# Altium schematic sheet [9] EXTRAS.SchDoc
size A4
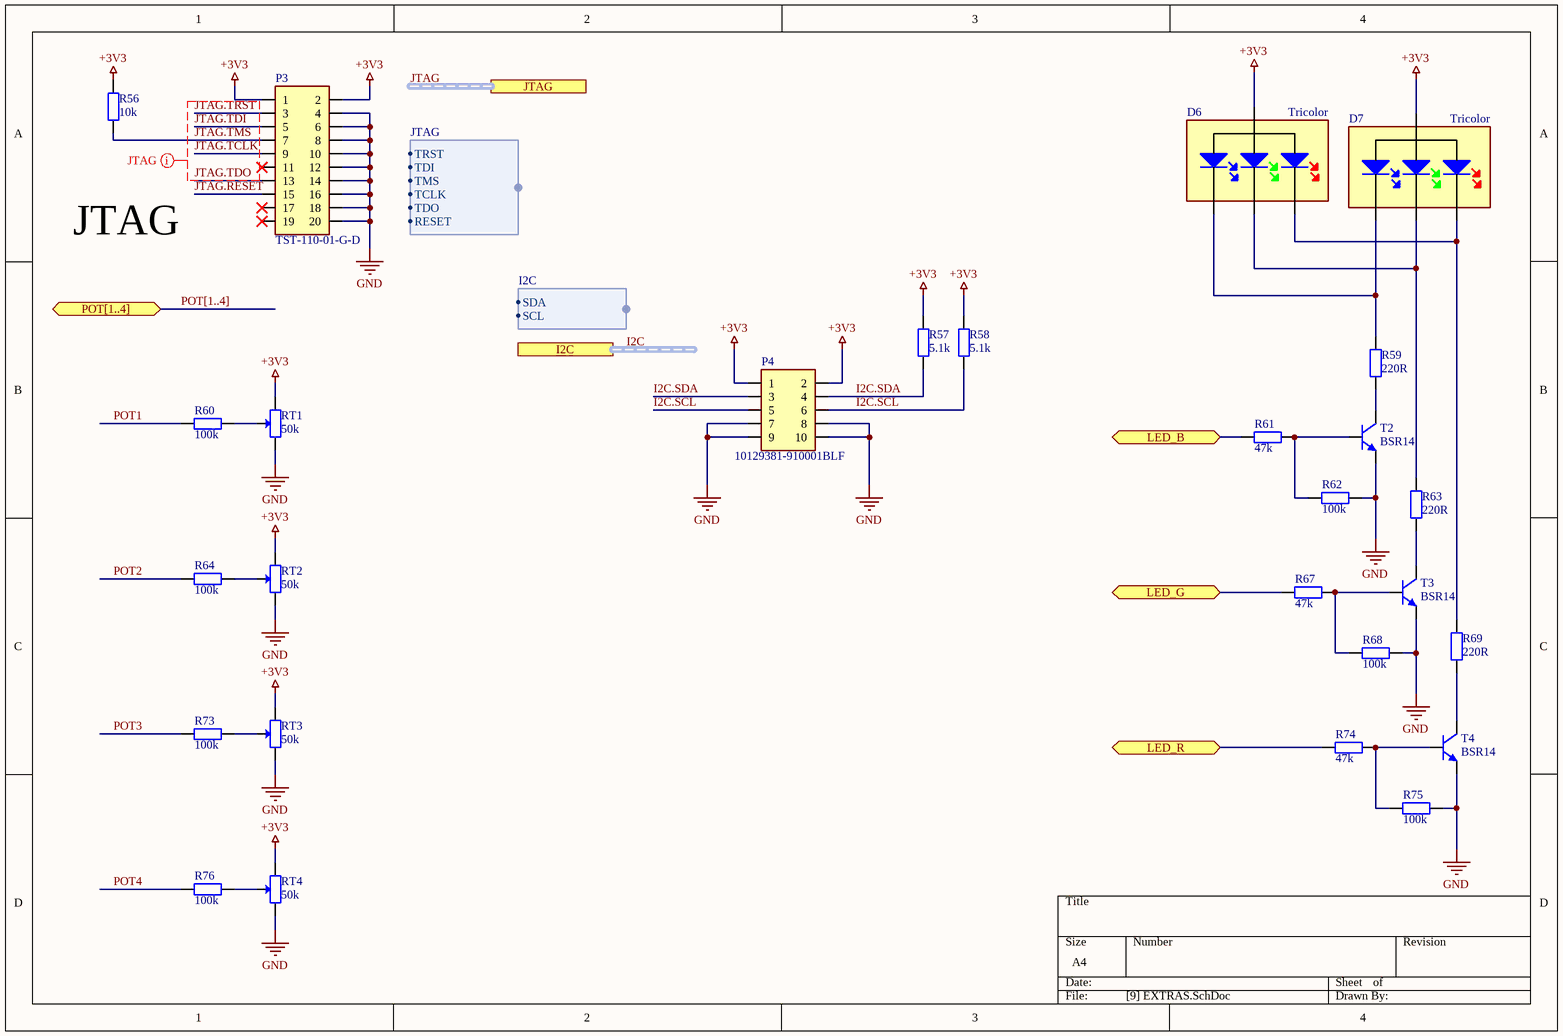
[diagram p0: [9] EXTRAS.SchDoc]

## Parts
D6  Tricolor  [LED RGB THT]
D7  Tricolor  [PLCC-4]
P3  TST-110-01-G-D  [20 pin 2.54mm male THT JTAG]
P4  10129381-910001BLF  [10 PIN THT]
R56  10k  [Resistor 0603]
R57  5.1k  [Resistor 0603]
R58  5.1k  [Resistor 0603]
R59  220R  [Resistor 0603]
R60  100k  [Resistor 0603]
R61  47k  [Resistor 0603]
R62  100k  [Resistor 0603]
R63  220R  [Resistor 0603]
R64  100k  [Resistor 0603]
R67  47k  [Resistor 0603]
R68  100k  [Resistor 0603]
R69  220R  [Resistor 0603]
R73  100k  [Resistor 0603]
R74  47k  [Resistor 0603]
R75  100k  [Resistor 0603]
R76  100k  [Resistor 0603]
RT1  50k  [PTV9]
RT2  50k  [PTV9]
RT3  50k  [PTV9]
RT4  50k  [PTV9]
T2  BSR14  [SOT23-3]
T3  BSR14  [SOT23-3]
T4  BSR14  [SOT23-3]

## Ports
I2C (harness I2C), JTAG (harness JTAG), LED_B (bidir), LED_G (bidir), LED_R (bidir), POT[1..4] (bidir)

## Harnesses
JTAG: TDI, TRST, TMS, TDO, RESET, TCLK
I2C: SDA, SCL

## Nets
+3V3: D6.2 D7.1 P3.1 P3.2 P4.1 P4.2 R56.2 R57.2 R58.2 RT1.3 RT2.3 RT3.3 RT4.3
GND: P3.4 P3.6 P3.8 P3.10 P3.12 P3.14 P3.16 P3.18 P3.20 P4.7 P4.8 P4.9 P4.10 R62.2 R68.2 R75.2 RT1.1 RT2.1 RT3.1 RT4.1 T2.3 T3.3 T4.3
I2C.SCL: P4.5 P4.6 R58.1
I2C.SDA: P4.3 P4.4 R57.1
JTAG.RESET: P3.15
JTAG.TCLK: P3.9
JTAG.TDI: P3.5
JTAG.TDO: P3.13
JTAG.TMS: P3.7 R56.1
JTAG.TRST: P3.3
LED_B: R61.2 ; port LED_B
LED_G: R67.2 ; port LED_G
LED_R: R74.2 ; port LED_R
POT1: R60.1
POT2: R64.1
POT3: R73.1
POT4: R76.1
NetD6_1: D6.1 D7.2 R69.2
NetD6_3: D6.3 D7.4 R59.2
NetD6_4: D6.4 D7.3 R63.2
NetR59_1: R59.1 T2.2
NetR60_2: R60.2 RT1.2
NetR61_1: R61.1 R62.1 T2.1
NetR63_1: R63.1 T3.2
NetR64_2: R64.2 RT2.2
NetR67_1: R67.1 R68.1 T3.1
NetR69_1: R69.1 T4.2
NetR73_2: R73.2 RT3.2
NetR74_1: R74.1 R75.1 T4.1
NetR76_2: R76.2 RT4.2

Not connected (* = marked no-connect by the designer): P3 11* 17* 19*

## Buses and harness runs
bus POT[1..4] = port POT[1..4]
harness I2C = port I2C
harness JTAG = port JTAG

## Layout directives
net class JTAG: JTAG.TCLK, JTAG.TDI, JTAG.TDO, JTAG.TMS, JTAG.TRST

## Notes on the sheet
- JTAG

## Library data of the parts
D6 = Diode Standard LEDs - Through Hole 5MM RGB LED: Standard LEDs - Through Hole 5MM RGB LED; Manufacturer Part Number: WP154A4SEJ3VBDZGC/CA; Manufacturer: Kingbright; Type: THT; Footprint: T-1 3/4 (5 mm); Datasheet: https://pl.mouser.com/datasheet/2/216/WP154A4SEJ3VBDZGC-CA-1145208.pdf
D7 = Diode Standard LEDs - SMD 2121 PLCC4 tricolor: Standard LEDs - SMD 2121 PLCC4 tricolor; Manufacturer Part Number: ASMB-LTB2-0A333; Manufacturer: Broadcom / Avago; Type: SMD; Datasheet: https://pl.mouser.com/datasheet/2/678/ASMB-LTB2-0A333-DS101-1827213.pdf
P3 = Mechanical Headers & Wire Housings .100" Shrouded Terminal Strip, Cable Mate TST-110-01-G-D: Headers & Wire Housings .100" Shrouded Terminal Strip, Cable Mate; Manufacturer: Samtec; Manufacturer Part Number: TST-110-01-G-D; Footprint: 20 Position; Type: THT; Datasheet: https://pl.mouser.com/datasheet/2/527/tst_th-1345646.pdf
P4 = Mechanical Headers & Wire Housings ECONOSTIK HEADER DR VT TH 2X5: Headers & Wire Housings ECONOSTIK HEADER DR VT TH 2X5; Manufacturer: Amphenol FCI; Manufacturer Part Number: 10129381-910001BLF; Footprint: 10 Position; Type: THT; Datasheet: https://www.amphenol-icc.com/media/wysiwyg/files/documentation/datasheet/boardwiretoboard/bwb_econostik_254headers.pdf
R56 = Resistor 10k 1% 0603 RT0603FRE0710KL: Thin Film Resistors - SMD 10K ohm 1% 1/10W; Manufacturer: Yageo; Manufacturer Part Number: RT0603FRE0710KL; Footprint: 0603; Type: SMD; Datasheet: https://pl.mouser.com/datasheet/2/447/PYu_RT_1_to_0_01_RoHS_L_11-1669912.pdf
R57 R58 = Resistor 5.1k 1% 0603 RT0603FRE075K1L: Thin Film Resistors - SMD 1/10W 5.1K ohm 1% 50ppm; Manufacturer: Yageo; Manufacturer Part Number: RT0603FRE075K1L; Footprint: 0603; Type: SMD; Datasheet: https://pl.mouser.com/datasheet/2/447/PYu_RT_1_to_0_01_RoHS_L_11-1669912.pdf
R59 R63 R69 = Resistor 220R 1% 0603 RT0603FRE07220RL: Thin Film Resistors - SMD 1/10W 220 ohm 1% 50ppm; Manufacturer: Yageo; Manufacturer Part Number: RT0603FRE07220RL; Footprint: 0603; Type: SMD; Datasheet: https://pl.mouser.com/datasheet/2/447/PYu_RT_1_to_0_01_RoHS_L_11-1669912.pdf
R60 R62 R64 R68 R73 R75 R76 = Resistor 100k 1% 0603 RT0603FRE07100KL: Thin Film Resistors - SMD 100K ohm 1% 1/10W; Manufacturer: Yageo; Manufacturer Part Number: RT0603FRE07100KL; Footprint: 0603; Type: SMD; Datasheet: https://pl.mouser.com/datasheet/2/447/PYu_RT_1_to_0_01_RoHS_L_11-1669912.pdf
R61 R67 R74 = Resistor 47k 1% 0603 RT0603FRE0747KL: Thin Film Resistors - SMD 1/10W 47K ohm 1% 50ppm; Manufacturer: Yageo; Manufacturer Part Number: RT0603FRE0747KL; Footprint: 0603; Type: SMD; Datasheet: https://pl.mouser.com/datasheet/2/447/PYu_RT_1_to_0_01_RoHS_L_11-1669912.pdf
RT1-RT4 = Potentiometer PANEL CONTROL - 9MM-ST-CA 50 kohms 15 mm: PANEL CONTROL - 9MM-ST-CA 50 kohms 15 mm; Manufacturer Part Number: PTV09A-4015U-B503; Manufacturer: Bourns; Footprint: PTV09; Type: THT; Datasheet: https://pl.mouser.com/datasheet/2/54/ptv09-777818.pdf
T2-T4 = Transistor Bipolar Transistor - BJT NPN Transistor General Purpose: Bipolar Transistors - BJT NPN Transistor General Purpose; Manufacturer: ON Semiconductor / Fairchild; Type: SMD; Manufacturer Part Number: BSR14; Footprint: SOT-23-3; Datasheet: https://pl.mouser.com/datasheet/2/308/BSR14-D-1802416.pdf